# EAGLE design fix_it_in_sw (EAGLE 5.12)
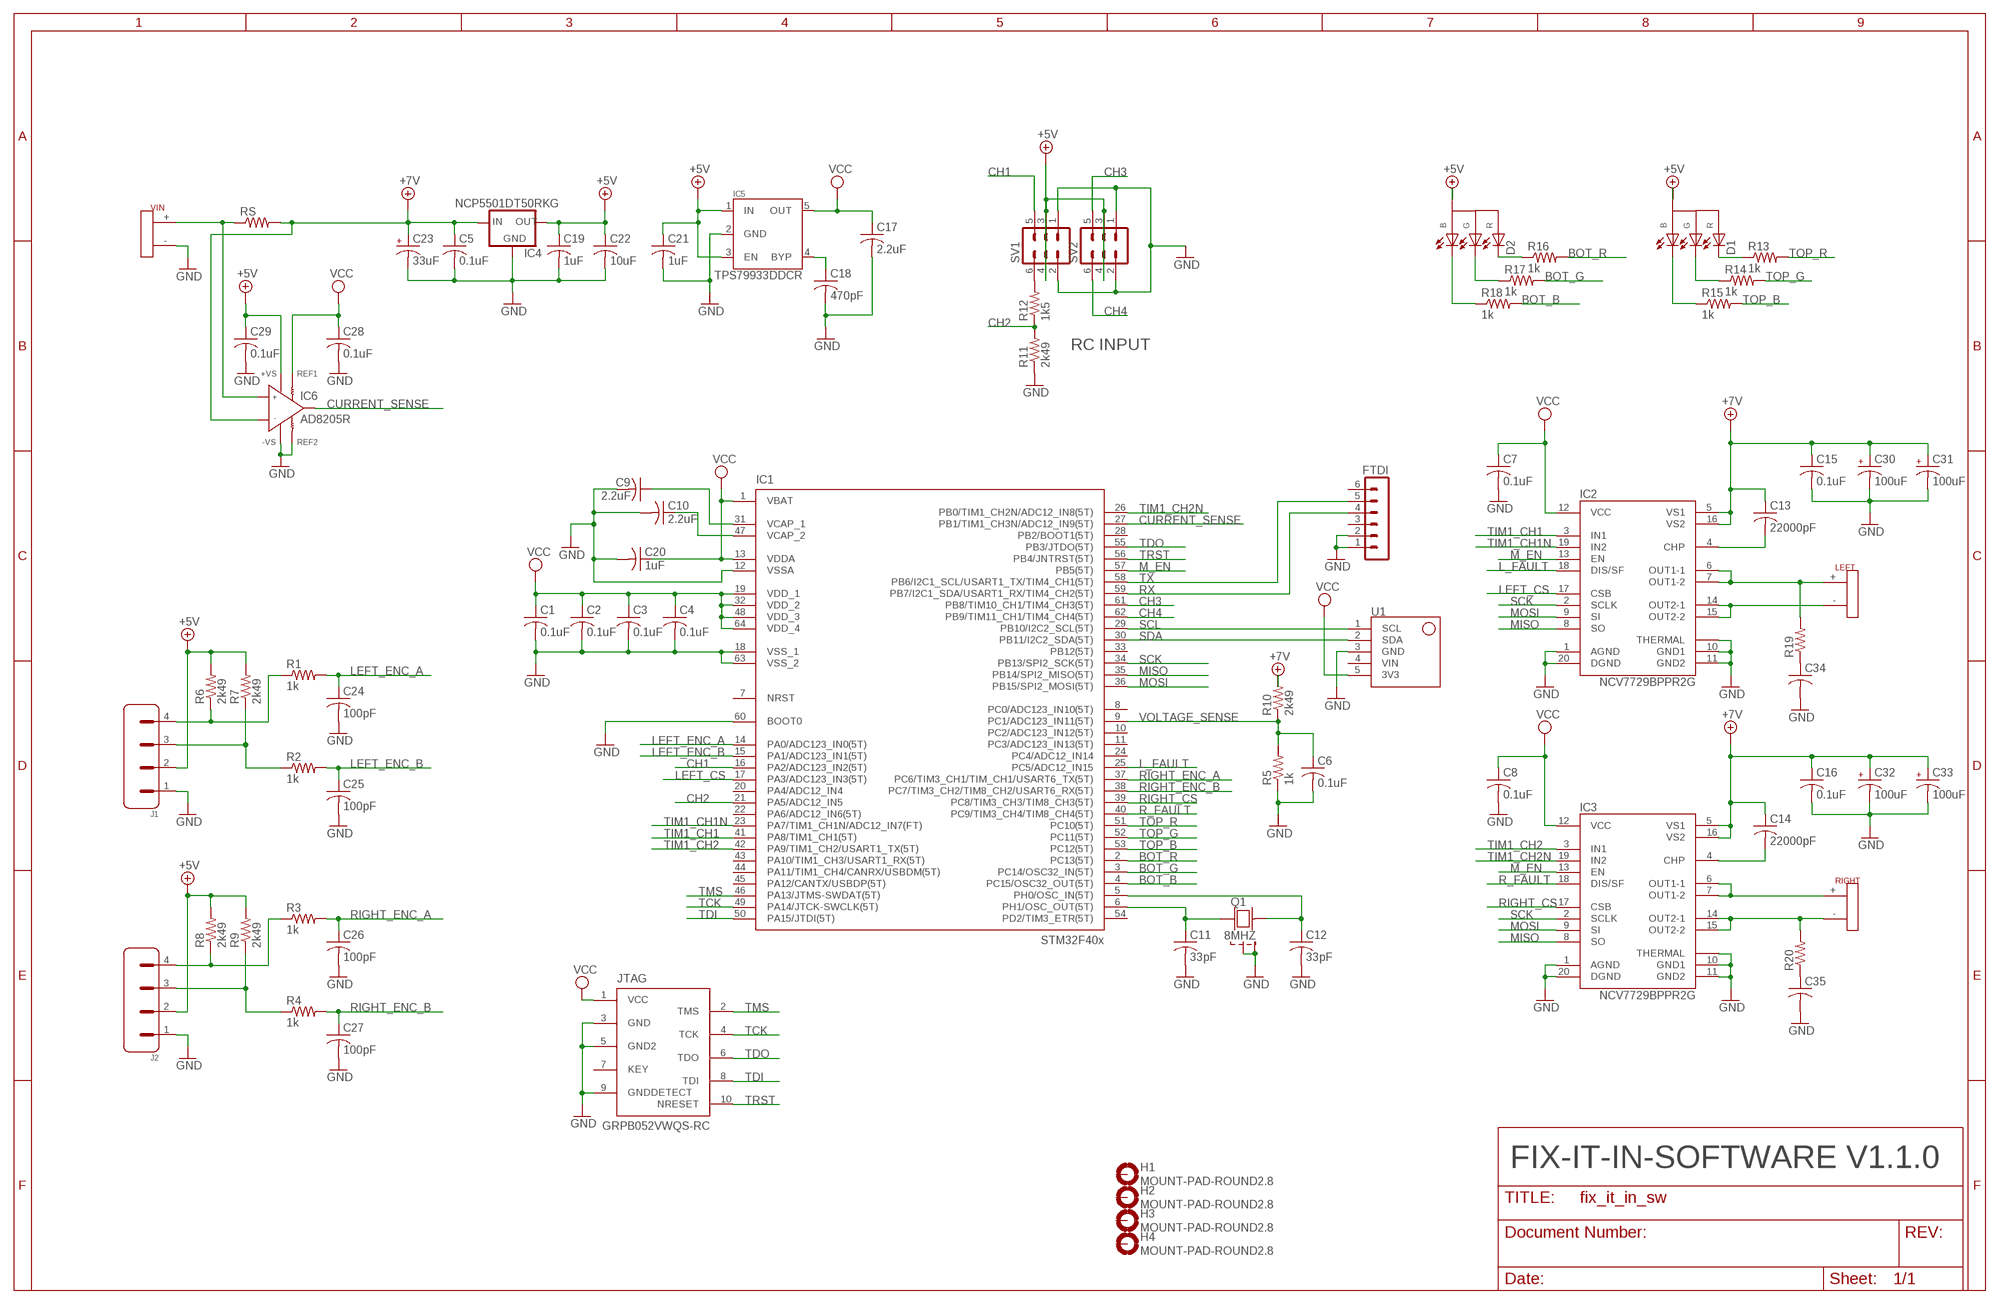
[diagram p0: schematic, sheet 1]

## Parts
C1  0.1uF  C1608X7R1H104K  [C0603]
C2  0.1uF  C1608X7R1H104K  [C0603]
C3  0.1uF  C1608X7R1H104K  [C0603]
C4  0.1uF  C1608X7R1H104K  [C0603]
C5  0.1uF  C1608X7R1H104K  [C0603]
C6  0.1uF  C1608X7R1H104K  [C0603]
C7  0.1uF  C1608X7R1H104K  [C0603]
C8  0.1uF  C1608X7R1H104K  [C0603]
C9  2.2uF  C1608X5R1C225K  [C0603]
C10  2.2uF  C1608X5R1C225K  [C0603]
C11  33pF  C-USC0402  [C0402]
C12  33pF  C-USC0402  [C0402]
C13  22000pF  C-USC0603  [C0603]
C14  22000pF  C-USC0603  [C0603]
C15  0.1uF  C1608X7R1H104K  [C0603]
C16  0.1uF  C1608X7R1H104K  [C0603]
C17  2.2uF  C1608X5R1C225K  [C0603]
C18  470pF  C-USC0603  [C0603]
C19  1uF  C-USC0603  [C0603]
C20  1uF  C-USC0603  [C0603]
C21  1uF  C-USC0603  [C0603]
C22  10uF  C-USC0603  [C0603]
C23  33uF  PCE3904CT-ND  [PANASONIC_C]
C24  100pF  C1608C0G1H101J  [C0603]
C25  100pF  C1608C0G1H101J  [C0603]
C26  100pF  C1608C0G1H101J  [C0603]
C27  100pF  C1608C0G1H101J  [C0603]
C28  0.1uF  C1608X7R1H104K  [C0603]
C29  0.1uF  C1608X7R1H104K  [C0603]
C30  100uF  RPS1C101MCN1GS  [PANASONIC_F]
C31  100uF  RPS1C101MCN1GS  [PANASONIC_F]
C32  100uF  RPS1C101MCN1GS  [PANASONIC_F]
C33  100uF  RPS1C101MCN1GS  [PANASONIC_F]
C34  C1608X7R1H104K  [C0603]
C35  C1608X7R1H104K  [C0603]
D1  CLV1A-FKB-CJ1M1F1BB7R4S3  [CREE-PLCC-4]
D2  CLV1A-FKB-CJ1M1F1BB7R4S3  [CREE-PLCC-4]
FTDI  MA06-1  [MA06-1]
H1  MOUNT-PAD-ROUND2.8  [2,8-PAD]
H2  MOUNT-PAD-ROUND2.8  [2,8-PAD]
H3  MOUNT-PAD-ROUND2.8  [2,8-PAD]
H4  MOUNT-PAD-ROUND2.8  [2,8-PAD]
IC1  STM32F405RG  [TQFP64]
IC2  NCV7729BPPR2G  [PSOP-20]
IC3  NCV7729BPPR2G  [PSOP-20]
IC4  NCP5501DT50RKG  [DPAK]
IC5  TPS79933DDCR  [SOT-23-5]
IC6  AD8205R  [SO8]
J1  502443-0470  [502443-0470]
J2  502443-0470  [502443-0470]
JTAG  GRPB052VWQS-RC  [DEBUG]
LEFT  POWER  [POWER]
Q1  8MHZ  ABM3B-8.000MHZ-B2-T  [4LCC]
R1  1k  R-US_R0603  [R0603]
R2  1k  R-US_R0603  [R0603]
R3  1k  R-US_R0603  [R0603]
R4  1k  R-US_R0603  [R0603]
R5  1k  R-US_R0603  [R0603]
R6  2k49  R-US_R0603  [R0603]
R7  2k49  R-US_R0603  [R0603]
R8  2k49  R-US_R0603  [R0603]
R9  2k49  R-US_R0603  [R0603]
R10  2k49  R-US_R0603  [R0603]
R11  2k49  R-US_R0603  [R0603]
R12  1k5  R-US_R0603  [R0603]
R13  1k  R-US_R0603  [R0603]
R14  1k  R-US_R0603  [R0603]
R15  1k  R-US_R0603  [R0603]
R16  1k  R-US_R0603  [R0603]
R17  1k  R-US_R0603  [R0603]
R18  1k  R-US_R0603  [R0603]
R19  R-US_R0603  [R0603]
R20  R-US_R0603  [R0603]
RIGHT  POWER  [POWER]
RS  R-US_R2512  [R2512]
SV1  MA03-2  [MA03-2]
SV2  MA03-2  [MA03-2]
U1  MINI9IMU  [MINI9IMU]
VIN  POWER  [POWER]

## Nets
+5V: C19.1 C21.1 C22.1 C29.1 D1.2 D2.2 IC4.3(OUT) IC5.1(IN) IC5.3(EN) IC6.6(+VS) J1.2 J2.2 R6.2 R7.2 R8.2 R9.2 SV1.3 SV1.4 SV2.3 SV2.4
+7V: C5.1 C13.1 C14.1 C15.1 C16.1 C23.+ C30.+ C31.+ C32.+ C33.+ IC2.5(VS1) IC2.16(VS2) IC3.5(VS1) IC3.16(VS2) IC4.1(IN) IC6.1(IN-) R10.2 RS.2
BOT_B: IC1.4(PC15/OSC32_OUT(5T)) R18.2
BOT_G: IC1.3(PC14/OSC32_IN(5T)) R17.2
BOT_R: IC1.2(PC13(5T)) R16.2
CH1: IC1.16(PA2/ADC123_IN2(5T)) SV1.5
CH2: IC1.21(PA5/ADC12_IN5) R11.2 R12.1
CH3: IC1.61(PB8/TIM10_CH1/TIM4_CH3(5T)) SV2.5
CH4: IC1.62(PB9/TIM11_CH1/TIM4_CH4(5T)) SV2.6
CURRENT_SENSE: IC1.27(PB1/TIM1_CH3N/ADC12_IN9(5T)) IC6.5(OUT)
GND: C1.2 C2.2 C3.2 C4.2 C5.2 C6.2 C7.2 C8.2 C9.2 C10.2 C11.2 C12.2 C15.2 C16.2 C17.2 C18.2 C19.2 C20.2 C21.2 C22.2 C23.- C24.2 C25.2 C26.2 C27.2 C28.2 C29.2 C30.- C31.- C32.- C33.- C34.2 C35.2 FTDI.1 FTDI.2 IC1.12(VSSA) IC1.18(VSS_1) IC1.60(BOOT0) IC1.63(VSS_2) IC2.1(AGND) IC2.10(GND1) IC2.11(GND2) IC2.20(DGND) IC2.THERMAL IC3.1(AGND) IC3.10(GND1) IC3.11(GND2) IC3.20(DGND) IC3.THERMAL IC4.4(GND) IC5.2(GND) IC6.2(-VS) IC6.3(REF2) J1.1 J2.1 JTAG.3(GND) JTAG.5(GND2) JTAG.9(GNDDETECT) Q1.2(G1) Q1.4(G2) R5.1 R11.1 SV1.1 SV1.2 SV2.1 SV2.2 U1.3(GND) VIN.-
L+: IC2.6(OUT1-1) IC2.7(OUT1-2) LEFT.+ R19.2
L-: IC2.14(OUT2-1) IC2.15(OUT2-2) LEFT.-
L_FAULT: IC1.25(PC5/ADC12_IN15) IC2.18(DIS/SF)
LEFT_CS: IC1.17(PA3/ADC123_IN3(5T)) IC2.17(CSB)
LEFT_ENC_A: C24.1 IC1.14(PA0/ADC123_IN0(5T)) R1.2
LEFT_ENC_B: C25.1 IC1.15(PA1/ADC123_IN1(5T)) R2.2
M_EN: IC1.57(PB5(5T)) IC2.13(EN) IC3.13(EN)
MISO: IC1.35(PB14/SPI2_MISO(5T)) IC2.8(SO) IC3.8(SO)
MOSI: IC1.36(PB15/SPI2_MOSI(5T)) IC2.9(SI) IC3.9(SI)
N$1: R12.2 SV1.6
N$2: C11.1 IC1.6(PH1/OSC_OUT(5T)) Q1.1
N$3: J1.4 R1.1 R6.1
N$4: C12.1 IC1.5(PH0/OSC_IN(5T)) Q1.3
N$5: J1.3 R2.1 R7.1
N$6: C9.1 IC1.31(VCAP_1)
N$7: C34.1 R19.1
N$8: C35.1 R20.1
N$11: C13.2 IC2.4(CHP)
N$13: J2.4 R3.1 R8.1
N$14: C10.1 IC1.47(VCAP_2)
N$15: C14.2 IC3.4(CHP)
N$16: C18.1 IC5.4(BYP)
N$17: D2.4 R18.1
N$18: J2.3 R4.1 R9.1
N$21: D2.3 R17.1
N$22: D2.1 R16.1
N$23: D1.1 R13.1
N$24: D1.3 R14.1
N$25: D1.4 R15.1
R+: IC3.6(OUT1-1) IC3.7(OUT1-2) RIGHT.+
R-: IC3.14(OUT2-1) IC3.15(OUT2-2) R20.2 RIGHT.-
R_FAULT: IC1.40(PC9/TIM3_CH4/TIM8_CH4(5T)) IC3.18(DIS/SF)
RIGHT_CS: IC1.39(PC8/TIM3_CH3/TIM8_CH3(5T)) IC3.17(CSB)
RIGHT_ENC_A: C26.1 IC1.37(PC6/TIM3_CH1/TIM_CH1/USART6_TX(5T)) R3.2
RIGHT_ENC_B: C27.1 IC1.38(PC7/TIM3_CH2/TIM8_CH2/USART6_RX(5T)) R4.2
RX: FTDI.4 IC1.59(PB7/I2C1_SDA/USART1_RX/TIM4_CH2(5T))
SCK: IC1.34(PB13/SPI2_SCK(5T)) IC2.2(SCLK) IC3.2(SCLK)
SCL: IC1.29(PB10/I2C2_SCL(5T)) U1.1(SCL)
SDA: IC1.30(PB11/I2C2_SDA(5T)) U1.2(SDA)
TCK: IC1.49(PA14/JTCK-SWCLK(5T)) JTAG.4(TCK)
TDI: IC1.50(PA15/JTDI(5T)) JTAG.8(TDI)
TDO: IC1.55(PB3/JTDO(5T)) JTAG.6(TDO)
TIM1_CH1: IC1.41(PA8/TIM1_CH1(5T)) IC2.3(IN1)
TIM1_CH1N: IC1.23(PA7/TIM1_CH1N/ADC12_IN7(FT)) IC2.19(IN2)
TIM1_CH2: IC1.42(PA9/TIM1_CH2/USART1_TX(5T)) IC3.3(IN1)
TIM1_CH2N: IC1.26(PB0/TIM1_CH2N/ADC12_IN8(5T)) IC3.19(IN2)
TMS: IC1.46(PA13/JTMS-SWDAT(5T)) JTAG.2(TMS)
TOP_B: IC1.53(PC12(5T)) R15.2
TOP_G: IC1.52(PC11(5T)) R14.2
TOP_R: IC1.51(PC10(5T)) R13.2
TRST: IC1.56(PB4/JNTRST(5T)) JTAG.10(NRESET)
TX: FTDI.5 IC1.58(PB6/I2C1_SCL/USART1_TX/TIM4_CH1(5T))
VCC: C1.1 C2.1 C3.1 C4.1 C7.1 C8.1 C17.1 C20.1 C28.1 IC1.1(VBAT) IC1.13(VDDA) IC1.19(VDD_1) IC1.32(VDD_2) IC1.48(VDD_3) IC1.64(VDD_4) IC2.12(VCC) IC3.12(VCC) IC5.5(OUT) IC6.7(REF1) JTAG.1(VCC) U1.5(3V3)
VIN: IC6.8(IN+) RS.1 VIN.+
VOLTAGE_SENSE: C6.1 IC1.9(PC1/ADC123_IN11(5T)) R5.2 R10.1
Unconnected: FTDI.3 FTDI.6 H1.B2,8(MOUNT) H2.B2,8(MOUNT) H3.B2,8(MOUNT) H4.B2,8(MOUNT) IC1.7(NRST) IC1.8(PC0/ADC123_IN10(5T)) IC1.10(PC2/ADC123_IN12(5T)) IC1.11(PC3/ADC123_IN13(5T)) IC1.20(PA4/ADC12_IN4) IC1.22(PA6/ADC12_IN6(5T)) IC1.24(PC4/ADC12_IN14) IC1.28(PB2/BOOT1(5T)) IC1.33(PB12(5T)) IC1.43(PA10/TIM1_CH3/USART1_RX(5T)) IC1.44(PA11/TIM1_CH4/CANRX/USBDM(5T)) IC1.45(PA12/CANTX/USBDP(5T)) IC1.54(PD2/TIM3_ETR(5T)) JTAG.7(KEY) U1.4(VIN)

## Notes on the sheet
- RC INPUT
- FIX-IT-IN-SOFTWARE V1.1.0

## Library data of the parts
C1-C8 C15 C16 C28 C29 = passive:C1608X7R1H104K: CAP CER 0.1UF 50V 10% X7R 0603
C9 C10 C17 = passive:C1608X5R1C225K: CAP CER 2.2UF 16V 10% X5R 0603
C11-C14 C18-C22 = rcl:C-US: CAPACITOR, American symbol
C23 = passive:PCE3904CT-ND: CAP ALUM 33uF 25V 5.00MM
C24-C27 = passive:C1608C0G1H101J: CAP CER 100PF 50V 5% NP0 0603
C30-C33 = passive:RPS1C101MCN1GS: CAP ALUM 100UF 16V 20% SMD Ripple Current: 3.2A ESR: 30mOhm Lifetime: 2000hrs @ 105C Size: 10mm x 10mm x 7.7mm
C34 C35 = passive:C1608X7R1H104K: CAP CER 0.1UF 50V 10% X7R 0603; VALUE: 0.1uF
D1 D2 = led:CLV1A-FKB-CJ1M1F1BB7R4S3: LED RED/GREEN/BLUE PLCC4 SMD reviewed: NO tested: NO
FTDI = con-lstb:MA06-1: PIN HEADER; OC_FARNELL: unknown; OC_NEWARK: unknown
H1-H4 = holes:MOUNT-PAD-ROUND: MOUNTING PAD, round
IC1 = stm32:STM32F405RG
IC2 IC3 = power:NCV7729BPPR2G: IC DRIVER DUAL H-BRIDGE 8A 20PSOP reviewed: NO tested: NO
IC4 = power:NCP5501DT50RKG: IC LDO REG 5V 500MA DPAK3 reviewed: NO tested: NO
IC5 = power:TPS79933DDCR: IC LDO REG 200MA 3.3V TSOT-23-5 reviewed: YES tested: YES
IC6 = robots:AD8205
J1 J2 = molex:502443-0470: Clik-Mate Vertical 4P 2.00mm reviewed: NO tested: NO
JTAG = stm32:GRPB052VWQS-RC: CONN HEADER 0.050" 10PS DL SMD AU reviewed: YES tested: YES
LEFT RIGHT VIN = robots:POWER
Q1 = stm32:ABM3B-8.000MHZ-B2-T: CRYSTAL, 8.000MHZ 18PF SMD reviewed: YES tested: YES
R1-R20 RS = rcl:R-US_: RESISTOR, American symbol
SV1 SV2 = con-lstb:MA03-2: PIN HEADER; OC_FARNELL: unknown; OC_NEWARK: unknown
U1 = robots:MINI9IMU

## Board
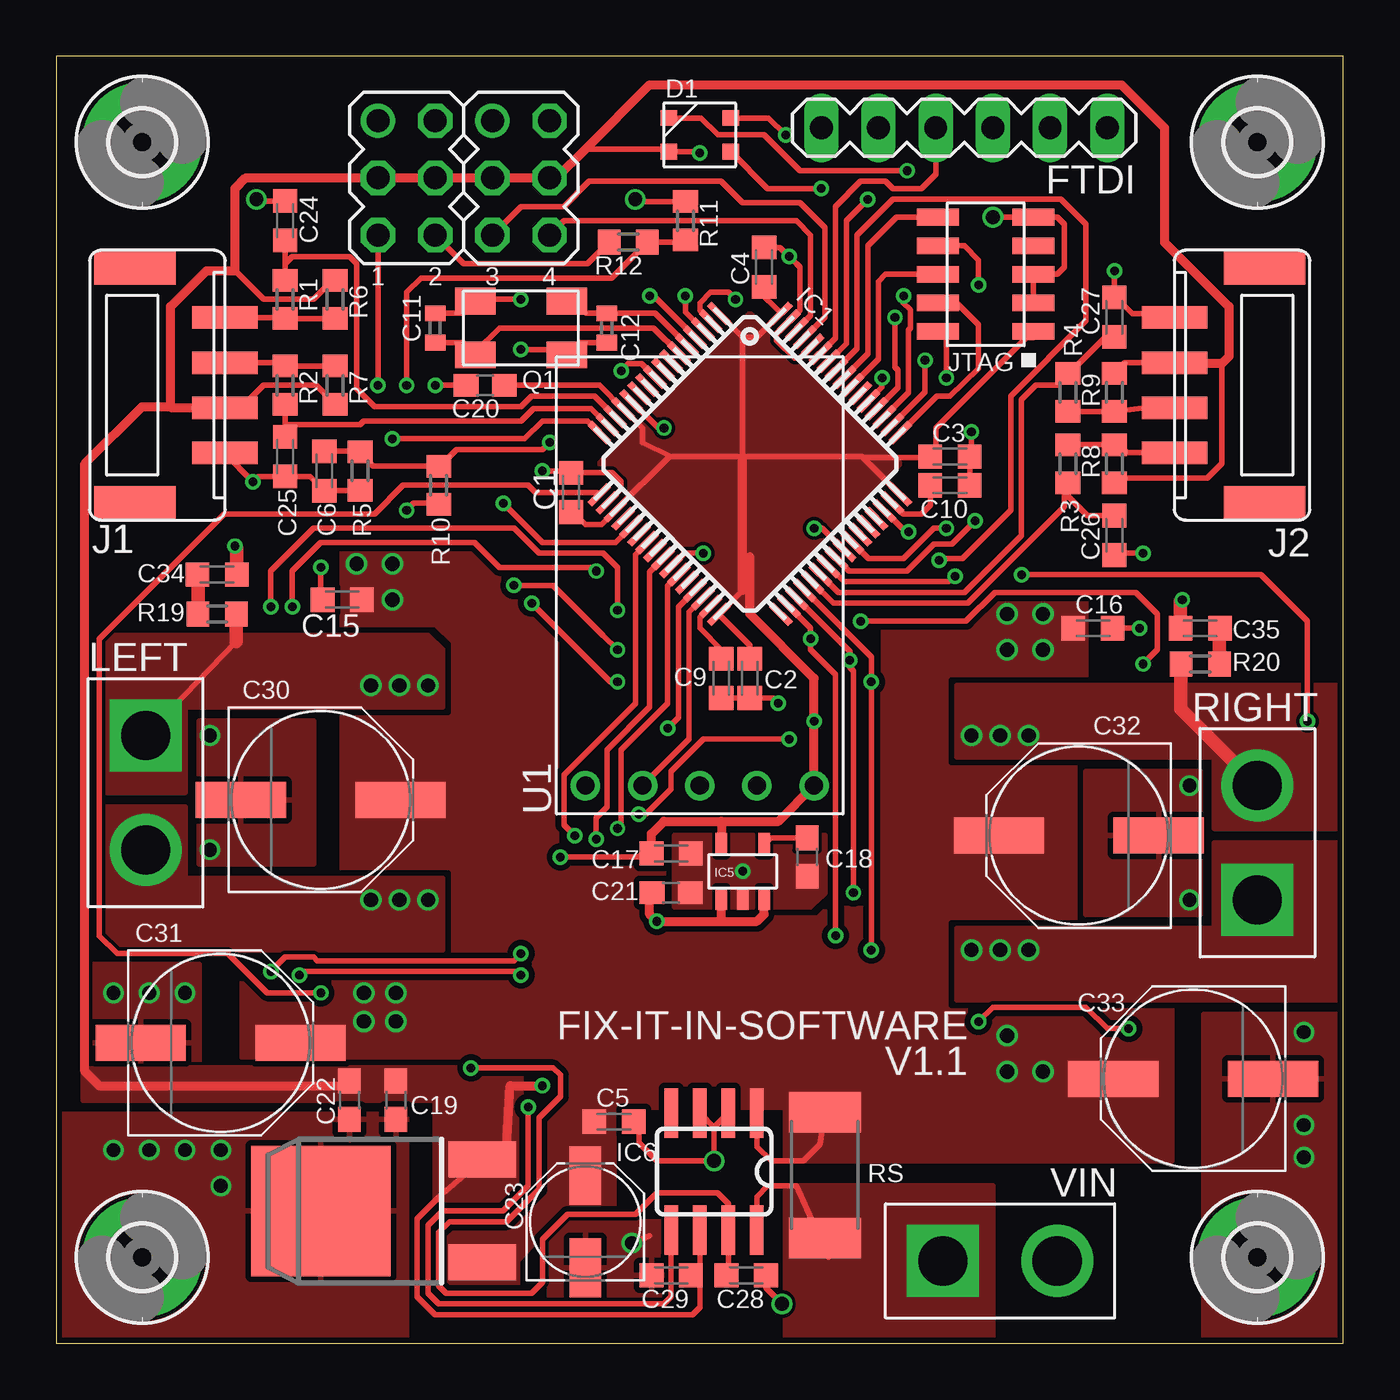
[diagram p1: board, top side]
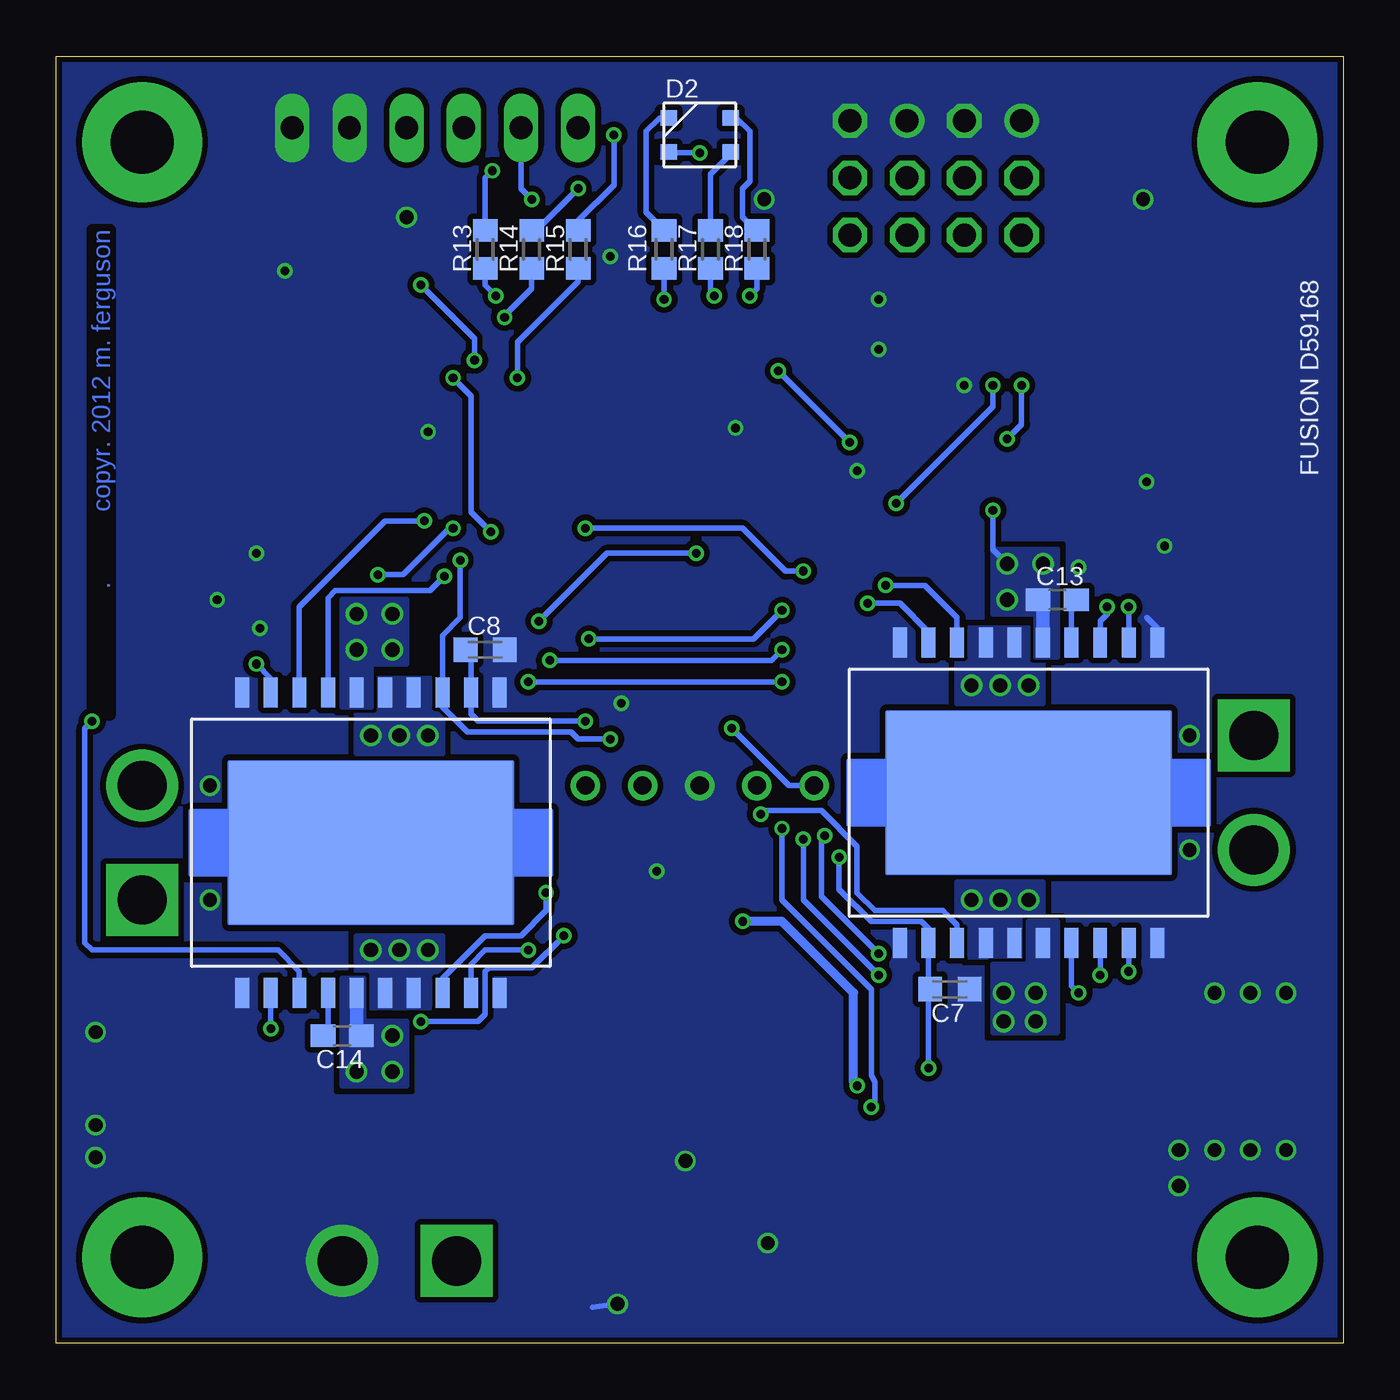
[diagram p2: board, bottom side, seen from below]

Size 57.15 x 57.15 mm. Coordinates in mm from the lower left corner, seen from the top.
Outline: 0,0 57.15,0 57.15,57.15 0,57.15 0,0
Copper layers (1*16): Top 0.035mm / dielectric 1.5mm / Bottom 0.035mm
Design rules "Fusion_eagle_rule_v1.1": minimum track width 6mil, minimum drill 12mil, track to track 6mil, track to pad 6mil, pad to pad 6mil, via to via 6mil, smd to smd 0mil, copper to edge 10mil, drill to drill 10mil, minimum pad ring 10mil, minimum via ring 6mil, stop-mask expansion 2mil, vias tented up to drill 100mil, thermal gap 10mil

### Footprints (pad centres in the part's own frame; a part is rotated, then mirrored left to right if it is on the bottom)
C0603 = smd 1.05 x 1.08: 1 -0.875,0; 2 0.875,0
C0402 = smd 0.7 x 0.9: 1 -0.65,0; 2 0.65,0
C0603' = smd 1.1 x 1: 1 -0.85,0; 2 0.85,0
PANASONIC_C = smd 2.6 x 1.4: + 2.05,0; - -2.05,0
PANASONIC_F = smd 4 x 1.6: + 3.55,0; - -3.55,0
CREE-PLCC-4 = smd 0.75 x 0.7: 1 -1.375,0.75; 2 -1.375,-0.75; 3 1.375,-0.75; 4 1.375,0.75
MA06-1 = drill 1.016 long: 1 -6.35,0; 2 -3.81,0; 3 -1.27,0; 4 1.27,0; 5 3.81,0; 6 6.35,0
2,8-PAD = drill 2.8 pad 5.334 round: B2,8 0,0
TQFP64 = smd 1.2 x 0.3: 1 -5.7,3.75; 2 -5.7,3.25; 3 -5.7,2.75; 4 -5.7,2.25; 5 -5.7,1.75; 6 -5.7,1.25; 7 -5.7,0.75; 8 -5.7,0.25; 9 -5.7,-0.25; 10 -5.7,-0.75; 11 -5.7,-1.25; 12 -5.7,-1.75; 13 -5.7,-2.25; 14 -5.7,-2.75; 15 -5.7,-3.25; 16 -5.7,-3.75; 33 5.7,-3.75; 34 5.7,-3.25; 35 5.7,-2.75; 36 5.7,-2.25; 37 5.7,-1.75; 38 5.7,-1.25; 39 5.7,-0.75; 40 5.7,-0.25; 41 5.7,0.25; 42 5.7,0.75; 43 5.7,1.25; 44 5.7,1.75; 45 5.7,2.25; 46 5.7,2.75; 47 5.7,3.25; 48 5.7,3.75 | smd 0.3 x 1.2: 17 -3.75,-5.7; 18 -3.25,-5.7; 19 -2.75,-5.7; 20 -2.25,-5.7; 21 -1.75,-5.7; 22 -1.25,-5.7; 23 -0.75,-5.7; 24 -0.25,-5.7; 25 0.25,-5.7; 26 0.75,-5.7; 27 1.25,-5.7; 28 1.75,-5.7; 29 2.25,-5.7; 30 2.75,-5.7; 31 3.25,-5.7; 32 3.75,-5.7; 49 3.75,5.7; 50 3.25,5.7; 51 2.75,5.7; 52 2.25,5.7; 53 1.75,5.7; 54 1.25,5.7; 55 0.75,5.7; 56 0.25,5.7; 57 -0.25,5.7; 58 -0.75,5.7; 59 -1.25,5.7; 60 -1.75,5.7; 61 -2.25,5.7; 62 -2.75,5.7; 63 -3.25,5.7; 64 -3.75,5.7
PSOP-20 = smd 1.33 x 0.62: 1 -6.665,5.715; 2 -6.665,4.445; 3 -6.665,3.175; 4 -6.665,1.905; 5 -6.665,0.635; 6 -6.665,-0.635; 7 -6.665,-1.905; 8 -6.665,-3.175; 9 -6.665,-4.445; 10 -6.665,-5.715; 11 6.665,-5.715; 12 6.665,-4.445; 13 6.665,-3.175; 14 6.665,-1.905; 15 6.665,-0.635; 16 6.665,0.635; 17 6.665,1.905; 18 6.665,3.175; 19 6.665,4.445; 20 6.665,5.715 | smd 7.2 x 12.6: THERMAL 0,0
DPAK = smd 3 x 1.6: 1 7.18,-2.29; 3 7.18,2.29 | smd 6.2 x 5.8: 4 0,0
SOT-23-5 = smd 0.508 x 1.016: 1 -0.95,-1.2; 2 0,-1.2; 3 0.95,-1.2; 4 0.95,1.2; 5 -0.95,1.2
SO8 = smd 0.6 x 2.2: 1 -1.905,-2.6; 2 -0.635,-2.6; 3 0.635,-2.6; 4 1.905,-2.6; 5 1.905,2.6; 6 0.635,2.6; 7 -0.635,2.6; 8 -1.905,2.6
502443-0470 = smd 1 x 2.9: 1 3,4; 2 1,4; 3 -1,4; 4 -3,4 | smd 1.45 x 3.6: P$5 -5.2,0; P$6 5.2,0
DEBUG = smd 1.854 x 0.737: 1 -2.121,2.54; 2 2.121,2.54; 3 -2.121,1.27; 4 2.121,1.27; 5 -2.121,0; 6 2.121,0; 7 -2.121,-1.27; 8 2.121,-1.27; 9 -2.121,-2.54; 10 2.121,-2.54
POWER = drill 2.184 square: + 0,0 | drill 2.184 round: - 5.08,0
4LCC = smd 1.803 x 1.194: 1 -2.032,-1.194; 2 2.032,-1.194; 3 2.032,1.194; 4 -2.032,1.194
R0603 = smd 1 x 1.1: 1 -0.85,0; 2 0.85,0
R2512 = smd 1.8 x 3.2: 1 -2.8,0; 2 2.8,0
MA03-2 = drill 1.016 round: 1 -2.54,-1.27 | drill 1.016 octagon: 2 -2.54,1.27; 3 0,-1.27; 4 0,1.27; 5 2.54,-1.27; 6 2.54,1.27
MINI9IMU = drill 0.8 round: 1 0,5.08; 2 0,2.54; 3 0,0; 4 0,-2.54; 5 0,-5.08

### Placement (x,y rotation side)
C1  22.86,37.78 90 top
C2  30.8,29.53 270 top
C3  39.69,39.37 0 top
C4  31.43,47.78 90 top
C5  24.77,9.84 0 top
C6  11.91,38.73 270 top
C7  17.46,15.72 0 bottom
C8  38.1,30.8 0 bottom
C9  29.53,29.53 270 top
C10  39.69,38.1 0 top
C11  16.83,45.09 90 top
C12  24.45,45.09 270 top
C13  22000pF  [C0603']  12.7,33.02 0 bottom
C14  22000pF  [C0603']  44.45,13.65 180 bottom
C15  12.7,33.02 180 top
C16  46.04,31.75 0 top
C17  27.3,21.75 0 top
C18  470pF  [C0603']  33.34,21.59 270 top
C19  1uF  [C0603']  15.08,10.79 270 top
C20  1uF  [C0603']  19.05,42.55 180 top
C21  1uF  [C0603']  27.3,20 0 top
C22  10uF  [C0603']  13.02,10.79 270 top
C23  23.5,5.4 90 top
C24  10.16,49.85 90 top
C25  10.16,39.37 270 top
C26  46.99,35.88 270 top
C27  46.99,45.56 90 top
C28  30.64,3.02 0 top
C29  27.3,3.02 180 top
C30  11.75,24.13 0 top
C31  7.3,13.34 0 top
C32  45.4,22.54 180 top
C33  50.48,11.75 180 top
C34  7.14,34.13 0 top
C35  50.8,31.75 180 top
D1  28.57,53.66 0 top
D2  28.57,53.66 0 bottom
FTDI  40.32,53.98 180 top
H1  53.34,53.34 0 top
H2  3.81,53.34 0 top
H3  53.34,3.81 0 top
H4  3.81,3.81 0 top
IC1  30.8,39.05 315 top
IC2  13.97,24.45 270 bottom
IC3  43.18,22.23 90 bottom
IC4  11.75,5.87 0 top
IC5  30.48,20.95 0 top
IC6  29.21,7.62 180 top
J1  3.49,42.55 270 top
J2  53.66,42.55 90 top
JTAG  41.27,47.47 180 top
LEFT  3.97,26.99 270 top
Q1  20.64,45.09 0 top
R1  10.16,46.35 90 top
R2  10.16,42.55 270 top
R3  44.93,39.05 270 top
R4  44.93,42.23 90 top
R5  13.49,38.73 90 top
R6  12.38,46.35 90 top
R7  12.38,42.55 270 top
R8  46.99,39.05 270 top
R9  46.99,42.23 90 top
R10  16.99,38.1 270 top
R11  27.94,49.85 270 top
R12  25.4,48.9 180 top
R13  38.1,48.58 270 bottom
R14  36.04,48.58 270 bottom
R15  33.97,48.58 270 bottom
R16  30.16,48.58 270 bottom
R17  28.1,48.58 270 bottom
R18  26.04,48.58 270 bottom
R19  7.14,32.38 0 top
R20  50.8,30.16 180 top
RIGHT  53.34,19.68 90 top
RS  34.13,7.46 90 top
SV1  15.56,51.75 270 top
SV2  20.64,51.75 270 top
U1  28.57,24.77 90 top
VIN  39.37,3.65 0 top

### Tracks (layer width: path | path; a pad name or v marks a point on that pad's centre or on a via)
+5V  (via drill 0.38)
  Top 0.254: 28.57,3.09 C29.1 | J1.2 8.21,41.55 9.21,42.55 11.53,42.55 R7.2 | R6.2 12.28,47.2 11.43,46.35 9.21,46.35 7.94,47.62 | R8.2 47.09,38.42 51.12,38.42 51.75,39.05 51.75,43.5 | R9.2 47.46,43.55 J2.2 | 28.57,3.09 28.57,1.59 28.26,1.27 16.83,1.27 16.03,2.06 16.03,5.53 17,6.5 | 28.57,3.09 IC6.6 | 17,6.5 16.83,6.35 | 17,6.5 IC4.3 | 23.5,53.02 27.09,53.02 D1.2 28.3,52.91 v28.57,52.86
  Top 0.406: 31.43,19.37 IC5.3 31.43,19.05 31.11,18.73 29.53,18.73 | IC4.3 20,8.76 20.16,11.43 v21.59,11.43 | 29.53,18.73 v26.67,18.73 26.35,19.05 26.35,19.9 | 26.35,19.9 C21.1 | IC5.1 29.53,18.73 | 26.35,19.9 26.35,20 | C22.1 12.6,11.43 1.91,11.43 1.27,12.06 1.27,39.05 3.81,41.59 5.08,41.59 | 5.08,41.59 5.08,46.04 6.67,47.62 7.94,47.62 7.94,51.28 8.41,51.75 SV1.3 SV1.4 SV2.3 SV2.4 22.23,51.75 23.5,53.02 26.35,55.88 47.31,55.88 49.21,53.98 49.21,48.9 52.07,46.04 52.07,43.81 51.75,43.5 49.7,43.5 J2.2 | J1.2 5.13,41.55 5.08,41.59
  Bottom 0.254: D2.2 29.91,52.86 v28.57,52.86
  Bottom 0.406: v26.67,18.73 24.92,18.73 21.75,15.56 21.75,11.59 v21.59,11.43
  pour Top (isolate 0.254, no thermals): 16.83,6.35 17.46,6.35 19.68,6.35 20.64,7.3 20.64,12.22 1.59,12.22 1.27,12.06 1.19,12.06 1.19,10.79 16.83,10.79
+7V  (via drill 0.38, 0.64)
  Top 0.254: RS.2 33.91,8.83 33.18,8.1 31.75,8.1 31.11,8.73 IC6.1 | 16.73,37.31 R10.2 | v15.56,36.99 15.88,37.31 16.73,37.31 | 16.73,37.31 17.14,37.31
  Bottom 0.254: 13.34,33.12 C13.1 | C14.1 43.81,13.87 | v15.56,36.99 15.56,35.88 15.56,35.24 v14.92,34.61
  Bottom 0.61: IC2.5 13.34,33.12 | 43.81,13.87 IC3.5
  other vias: 42.23,13.65 42.23,12.06 43.81,12.06 42.23,30.8 14.92,33.02 15.08,15.56 13.65,15.56 13.65,14.29 15.08,14.29 13.34,34.61 43.81,30.8 43.81,32.38 42.23,32.38
  pour Top (isolate 0.254, rank 3, no thermals): 16.83,0.16 20.48,0.16 20.48,3.65 22.7,6.03 24.77,6.03 24.77,10.48 32.38,10.48 32.38,8.1 49.53,8.1 49.53,14.92 45.72,14.92 45.72,33.34 36.75,33.34 36.67,21.75 22.23,21.59 22.23,35.56 12.7,35.56 12.7,17.14 8.26,17.14 8.26,12.7 21.59,12.7 21.59,7.62 19.53,5.56 16.83,5.56
  pour Bottom (no thermals): 43.5,16.19 44.45,16.19 44.45,11.43 41.59,11.43 41.59,14.29 43.5,14.29
  pour Bottom (no thermals): 43.18,28.26 44.45,28.26 44.45,33.02 41.59,33.02 41.59,30.16 43.18,30.16
  pour Bottom (no thermals): 13.97,18.73 12.7,18.73 12.7,13.81 15.56,13.81 15.56,16.83 13.97,16.83
  pour Bottom (no thermals): 13.65,30.48 12.7,30.48 12.7,35.24 15.56,35.24 15.56,32.38 13.65,32.38
BOT_B  (via drill 0.38)
  Top 0.254: IC1.4 26.52,46.51 v26.35,46.51
  Bottom 0.254: v26.35,46.51 26.04,46.83 R18.2
BOT_G  (via drill 0.38)
  Top 0.254: IC1.3 27.94,45.8 v27.94,46.51
  Bottom 0.254: v27.94,46.51 28.1,46.67 R17.2
BOT_R  (via drill 0.38)
  Top 0.254: IC1.2 28.57,45.87 28.57,46.2 29.05,46.67 29.84,46.67 v30.16,46.35
  Bottom 0.254: v30.16,46.35 R16.2
CH1  (via drill 0.38)
  Top 0.254: IC1.16 23.59,40.96 21.59,40.96 20.8,40.16 v14.92,40.16 | v14.29,42.55 SV1.5
  Bottom 0.254: v14.92,40.16 14.29,40.8 v14.29,42.55
CH2  (via drill 0.38)
  Top 0.254: R11.2 27.84,48.9 R12.1 24.66,47.31 16.19,47.31 15.56,46.67 v15.56,42.55 | IC1.21 24.83,35.56 21.59,35.56 20.8,36.35 v19.84,37.31
  Bottom 0.254: v19.84,37.31 15.56,41.59 v15.56,42.55
CH3
  Top 0.254: IC1.61 34.13,45.57 34.13,49.53 33.02,50.64 30.48,50.64 29.53,51.59 23.65,51.59 22.54,50.48 20.64,50.48 SV2.5
CH4
  Top 0.254: IC1.62 33.5,45.64 33.5,49.21 32.86,49.85 22.54,49.85 SV2.6
CURRENT_SENSE  (via drill 0.38)
  Top 0.254: IC1.27 27.15,33.63 27.15,28.42 25.08,26.35 25.08,23.02 v24.92,22.86 | v20.95,10.48 20.95,10.16 20.95,6.99 19.84,5.87 17.14,5.87 16.51,5.24 16.51,2.22 16.99,1.75 26.99,1.75 27.3,2.06 IC6.5
  Bottom 0.254: v20.95,10.48 20.8,10.64 20.8,11.59 20.95,11.91 20.95,15.72 24.77,19.53 24.92,19.68 v24.92,22.86
GND  (via drill 0.38, 0.61)
  Top 0.254: 46.91,46.59 47.78,45.72 49.48,45.72 | 23.67,2.22 C23.- | R11.1 25.82,50.7 v25.72,50.8 | C24.2 8.89,50.72 v8.89,50.8 | v16.83,42.55 C20.2 | C10.2 C3.2 40.48,39.37 40.64,39.53 v40.64,40.48 | C26.2 47.07,35.08 v48.26,35.08 | C27.2 v46.99,47.62 | v41.59,50.01 JTAG.9 44.45,50.01 44.77,49.69 44.77,47.78 44.45,47.47 JTAG.5 JTAG.3 | C11.2 18.06,45.73 Q1.4 18.68,46.35 v20.64,46.35 | C5.2 25.88,9.45 25.88,8.89 26.67,8.1 v29.21,8.1 29.21,9.59 | v25.56,4.45 26.35,4.76 | 29.21,9.59 IC6.2 | 29.21,9.59 IC6.3 | 30.48,28.57 31.04,28.65 C2.2 | IC1.12 26.73,40.64 v26.99,40.64 | v20.64,44.13 22.43,44.13 Q1.2 23.21,44.44 C12.2 | R5.1 13.47,37.86 C6.2 11.27,38.49 C25.2 8.97,38.49 v8.73,38.26 7.49,39.5 J1.1 | C16.2 v48.1,31.75 | C9.2 C2.2 | v32.07,28.42 31.83,28.65 C2.2 | C15.2 11.75,33.02 v11.75,34.45 | v21.59,38.73 22.78,38.73 C1.2 24.68,38.66 25.08,38.26 25.08,37.93 IC1.18 | C4.2 32.15,48.66 v32.54,48.26 32.86,47.94 33.02,47.78 33.02,45.87 IC1.63 31.99,44.84 31.99,44.53 32.78,43.74 33.02,43.74 33.59,44.31 IC1.60 | C28.2 31.51,2.46 v32.23,1.75
  Top 0.305: C27.2 46.91,46.59 | 49.48,45.72 J2.1
  Top 0.61: C34.2 8.02,35.32 v7.94,35.4 | C35.2 49.92,32.94 v50.01,33.02
  Bottom 0.254: v32.23,1.75 33.34,1.59 | IC2.1 8.26,31.75 8.73,32.23
  other vias: 7.3,8.57 5.71,8.57 4.13,8.57 2.54,8.57 7.3,6.99 50.32,19.68 50.32,24.77 6.83,26.99 6.83,21.91 2.54,15.56 4.13,15.56 5.71,15.56 55.4,13.81 55.4,9.68 55.4,8.25 30.48,20.95
  pour Bottom (isolate 0.254, rank 3, no thermals): 0,57.15 57.15,57.15 57.15,0 0,0
  pour Top: 21.91,0 21.91,4.76 22.54,5.4 27.3,5.4 27.3,0
  pour Top: 15.56,10.16 15.56,0 0,0 0,10.16
  pour Top: 45.72,25.4 50.8,25.4 50.8,19.05 45.72,19.05
  pour Top: 6.35,27.62 11.43,27.62 11.43,21.27 6.35,21.27
  pour Top (rank 2): 0,16.83 6.35,16.83 6.35,12.38 0,12.38
  pour Top: 50.96,14.61 56.99,14.61 56.83,0.32 50.96,0.32
  pour Top (no thermals): 27.46,22.54 34.13,22.54 34.13,21.91 34.13,21.91 34.13,21.75 34.13,20 33.97,19.84 33.97,19.84 33.5,19.37 27.46,19.37
L+  (via drill 0.64)
  Top 0.254: LEFT.+ 7.99,31.17
  Top 0.61: 7.99,31.17 R19.2
  other vias: 13.97,29.21 15.24,29.21 16.51,29.21
  pour Top (no thermals): 0,24.45 5.71,24.45 5.71,28.26 17.14,28.26 17.14,30.8 16.51,31.43 0,31.43
  pour Bottom (rank 2, no thermals): 13.34,28.42 13.34,31.75 17.14,31.75 17.14,28.42
L-  (via drill 0.64)
  other vias: 13.97,19.68 15.24,19.68 16.51,19.68
  pour Bottom (rank 2, no thermals): 17.14,20.48 17.14,17.14 13.34,17.14 13.34,20.48
  pour Top (rank 2, no thermals): 5.71,23.81 0,23.81 0,17.46 17.14,17.46 17.14,20.64 5.71,20.64
L_FAULT  (via drill 0.38)
  Top 0.254: IC1.25 26.35,34.25 26.35,28.26 24.45,26.35 24.45,23.81 23.97,23.34 v23.97,22.38 | v10.79,16.35 | v10.79,16.35 | v10.79,16.35 10.95,16.51 20.48,16.51 v20.64,16.35
  Bottom 0.254: v10.79,16.35 IC2.18 | v23.97,22.38 23.97,19.68 v20.64,16.35
LEFT_CS  (via drill 0.38)
  Top 0.254: IC1.17 24.01,37.78 21.27,37.78 20.95,38.1 15.4,38.1 14.13,36.83 7.46,36.83 1.91,31.27 1.91,18.1 2.7,17.3 7.62,17.3 9.37,15.56 v11.75,15.56
  Bottom 0.254: IC2.17 12.06,15.88 v11.75,15.56
LEFT_ENC_A
  Top 0.254: 10.16,47.94 R1.2 | 10.16,47.94 C24.1 | IC1.14 23.89,42.07 21.11,42.07 20.64,41.59 14.13,41.59 13.34,42.39 13.34,47.94 13.02,48.26 10.48,48.26 10.16,47.94
LEFT_ENC_B
  Top 0.254: C25.1 R2.2 | IC1.15 23.74,41.52 21.2,41.52 20.64,40.96 13.65,40.96 13.49,40.8 10.16,40.8 C25.1 | C25.1 10.16,40.01
M_EN  (via drill 0.38)
  Top 0.254: IC1.57 35.56,44.17 35.56,49.21 37.15,50.8 44.61,50.8 45.72,49.69 45.72,45.4 42.39,42.07 42.39,36.99 41.91,36.51 40.24,34.85 39.29,34.85 v39.21,34.77 | v39.21,34.77 | v32.54,26.83 28.73,26.83 27.3,25.4 27.3,24.61 26.19,23.5 v25.88,23.5
  Bottom 0.254: v39.21,34.77 39.21,32.23 40.01,31.43 IC3.13 40.01,28.26 38.89,27.15 34.29,27.15 33.97,26.83 v32.54,26.83 | IC2.13 17.14,18.57 17.62,19.05 | 17.62,19.05 | 17.62,19.05 17.78,19.21 20.8,19.21 21.59,20 21.59,22.07 23.18,23.65 25.72,23.65 v25.88,23.5
MISO  (via drill 0.38)
  Top 0.254: v35.4,20 35.4,29.84 35.24,30 v35.24,30.32 35.24,30.72 IC1.35 | v20.32,33.66 22.07,33.66 24.29,31.43 v24.92,30.8
  Bottom 0.254: IC3.8 40.01,16.19 38.1,18.1 36.51,18.1 35.4,19.21 v35.4,20 | IC2.8 17.14,32.23 18.57,33.66 v20.32,33.66 | v24.92,30.8 25.4,30.32 26.67,30.32 v35.24,30.32
MOSI  (via drill 0.38)
  Top 0.254: IC1.36 36.2,30.47 v36.2,29.37 v36.2,17.46 | v21.11,32.86 | v21.11,32.86 21.91,32.07 24.61,29.37 v24.92,29.37
  Bottom 0.254: IC3.9 38.73,16.83 38.1,17.46 v36.2,17.46 | IC2.9 18.41,31.59 19.69,32.86 v21.11,32.86 | v24.92,29.37 v36.2,29.37
N$1
  Top 0.254: SV1.6 18.1,47.94 23.6,47.94 R12.2
N$2
  Top 0.254: C11.1 18.06,44.44 Q1.1 18.61,44.01 19.68,45.09 26.53,45.09 IC1.6
N$3
  Top 0.254: J1.4 10.12,45.55 R1.1 R6.1
N$4
  Top 0.254: Q1.3 23.53,45.73 C12.1 26.59,45.73 IC1.5
N$5
  Top 0.254: J1.3 10.01,43.55 R2.1 R7.1
N$6
  Top 0.254: IC1.31 28.57,32.23 28.57,31.75 29.53,30.8 C9.1
N$7
  Top 0.61: R19.1 6.29,34.11 C34.1
N$8
  Top 0.61: R20.1 51.65,31.73 C35.1
N$11
  Bottom 0.254: IC2.4 12.06,33.12 C13.2
N$13
  Top 0.254: J2.4 47.62,39.55 R8.1 R3.1
N$14
  Top 0.254: IC1.47 37.62,36.83 38.42,36.83 38.81,37.23 C10.1
N$15
  Bottom 0.254: IC3.4 45.09,13.87 C14.2
N$16
  Top 0.254: C18.1 31.71,22.44 IC5.4
N$17
  Bottom 0.254: R18.1 26.04,49.37 26.67,50.01 26.67,51.28 26.35,51.59 26.35,53.82 26.94,54.41 D2.4
N$18
  Top 0.254: R4.1 R9.1 49.66,41.7
  Top 0.305: 49.66,41.7 J2.3
N$21
  Bottom 0.254: R17.1 | R17.1 28.1,51.91 27.2,52.81 D2.3
N$22
  Bottom 0.254: R16.1 30.96,50.22 30.96,53.82 30.36,54.41 D2.1
N$23  (via drill 0.38)
  Top 0.254: v37.78,52.07 33.02,52.07 31.43,53.66 29.38,53.66 28.63,54.41 D1.1
  Bottom 0.254: R13.1 38.1,51.75 v37.78,52.07 | v37.78,52.07
N$24  (via drill 0.38)
  Top 0.254: v33.97,51.28 31.59,51.28 D1.3
  Bottom 0.254: R14.1 35.72,49.53 v33.97,51.28
N$25  (via drill 0.38)
  Top 0.254: v32.38,53.66 31.64,54.41 D1.4
  Bottom 0.254: R15.1 33.97,49.85 32.38,51.44 v32.38,53.66
R+  (via drill 0.64)
  other vias: 40.64,17.46 41.91,17.46 43.18,17.46
  pour Bottom (rank 2, no thermals): 43.81,18.1 43.81,14.92 40.01,14.92 40.01,18.1
  pour Top (no thermals): 57.15,22.23 51.44,22.23 51.44,18.41 40.01,18.41 40.01,15.24 57.15,15.24
R-  (via drill 0.64)
  Top 0.61: R20.2 49.95,28.16 RIGHT.-
  other vias: 40.64,26.99 41.91,26.99 43.18,26.99
  pour Bottom (rank 2, no thermals): 40.01,26.19 40.01,29.53 43.81,29.53 43.81,26.19
  pour Top (no thermals): 51.44,22.86 57.15,22.86 57.15,29.21 40.01,29.21 40.01,26.04 51.44,26.04
R_FAULT  (via drill 0.38)
  Top 0.254: IC1.40 35.21,34.29 37.78,34.29 38.97,35.48 39.53,35.48 | 39.53,35.48 | 39.53,35.48 39.77,35.48 | 39.77,35.48 39.85,35.56 | 39.77,35.48 v40.8,36.51
  Bottom 0.254: IC3.18 46.35,32.7 42.55,36.51 v40.8,36.51
RIGHT_CS  (via drill 0.38)
  Top 0.254: IC1.39 34.98,33.81 39.61,33.81 v39.93,34.05
  Bottom 0.254: v39.93,34.05 40.56,33.42 44.77,33.42 45.09,33.1 IC3.17
RIGHT_ENC_A
  Top 0.254: IC1.37 34.51,32.86 40.48,32.86 44.77,37.15 44.77,37.78 | 44.77,37.78 R3.2 | 44.77,37.78 45.8,36.75 C26.1
RIGHT_ENC_B
  Top 0.254: 44.77,42.86 44.45,42.55 43.5,42.55 42.86,41.91 42.86,35.88 40.32,33.34 34.74,33.34 IC1.38 | R4.2 45.3,43.4 46.67,44.77
  Top 0.305: 44.77,42.86 R4.2 | 46.67,44.77 C27.1
RX
  Top 0.254: IC1.59 34.61,44.63 34.61,50.48 35.72,51.59 36.83,51.59 37.15,51.28 38.42,51.28 39.05,51.91 FTDI.4
SCK  (via drill 0.38)
  Top 0.254: v34.61,18.1 34.61,29.69 33.5,30.8 v33.5,31.27 33.5,31.75 IC1.34 | v40.96,14.29 41.59,14.92 45.72,14.92 46.67,13.97 v47.62,13.97 | v9.53,32.7 9.53,34.29 11.43,36.2 20.32,36.2 21.43,35.08 23.81,35.08 24.29,35.08 24.92,34.45 v24.92,32.54
  Bottom 0.254: v34.61,18.1 36.04,16.67 37.94,16.67 38.1,16.51 38.1,14.61 38.42,14.29 v40.96,14.29 | v47.62,13.97 IC3.2 | IC2.2 v9.53,32.7 | v24.92,32.54 26.2,31.28 v33.49,31.28 v33.5,31.27
SCL  (via drill 0.38)
  Top 0.254: IC1.29 27.62,32.7 27.62,27.78 v27.15,27.3
  Bottom 0.254: U1.1 24.61,24.77 v27.15,27.3
SDA
  Top 0.254: IC1.30 28.1,32.47 28.1,26.83 26.35,25.08 U1.2
TCK
  Top 0.254: IC1.49 39.12,42.07 39.69,42.07 40.96,43.27 40.96,45.24 40.01,46.2 JTAG.4
TDI  (via drill 0.38)
  Top 0.254: IC1.50 38.58,42.23 v38.58,43.66 | v40.96,46.99 40.96,48.1 40.32,48.74 JTAG.8
  Bottom 0.254: v38.58,43.66 38.58,44.61 v40.96,46.99
TDO
  Top 0.254: IC1.55 36.51,43.71 36.51,47.15 36.83,47.47 JTAG.6
TIM1_CH1  (via drill 0.38)
  Top 0.254: IC1.41 34.01,36.2 v33.66,36.2 | v10.48,32.7 10.48,34.29 11.75,35.56 18.57,35.56 19.68,34.45 23.65,34.45 23.81,34.45 v23.97,34.29
  Bottom 0.254: v33.66,36.2 26.67,36.2 24.77,34.29 v23.97,34.29 | IC2.3 10.79,32.07 10.48,32.38 v10.48,32.7
TIM1_CH1N  (via drill 0.38)
  Top 0.254: IC1.23 25.72,35.03 25.72,28.42 22.54,25.24 22.54,23.02 v23.02,22.54 | v9.53,16.51 10.16,17.14 11.43,17.14 11.59,16.99 20.32,16.99 v20.64,17.3 | v23.02,22.54
  Bottom 0.254: v9.53,16.51 IC2.19 | v20.64,17.3 23.18,19.84 23.18,22.38 v23.02,22.54
TIM1_CH2  (via drill 0.38)
  Top 0.254: v55.56,27.62 55.56,32.07 53.5,34.13 v42.86,34.13 | v39.53,36.2 38.97,36.2 37.62,34.85 36.06,34.85 IC1.42
  Bottom 0.254: IC3.3 46.35,16.51 47.31,17.46 55.56,17.46 55.88,17.78 55.88,27.3 v55.56,27.62 | v42.86,34.13 41.75,34.13 39.69,36.2 v39.53,36.2
TIM1_CH2N  (via drill 0.38)
  Top 0.254: IC1.26 27.89,35.08 v28.73,35.08 | v35.72,32.07 40.4,32.07 41.67,33.34 47.94,33.34 48.9,32.38 48.9,30.8 v48.26,30.16
  Bottom 0.254: v28.73,35.08 32.7,35.08 v35.72,32.07 | v48.26,30.16 47.62,29.53 IC3.19
TMS  (via drill 0.38)
  Top 0.254: IC1.46 37.7,36.04 v37.86,36.04 | v39.53,42.86 39.63,42.96 39.53,43.07 39.53,44.77 JTAG.2
  Bottom 0.254: v37.86,36.04 38.73,36.91 38.73,42.07 v39.53,42.86
TOP_B  (via drill 0.38)
  Top 0.254: IC1.53 36.67,42.45 v36.67,42.86
  Bottom 0.254: v36.67,42.86 36.67,44.45 33.97,47.15 R15.2
TOP_G  (via drill 0.38)
  Top 0.254: IC1.52 37.37,42.44 37.37,43.21 37.24,43.34 v37.24,45.56
  Bottom 0.254: v37.24,45.56 37.15,45.72 36.04,46.83 R14.2
TOP_R  (via drill 0.38)
  Top 0.254: IC1.51 37.85,42.21 37.85,44.99 | 37.85,44.99 | 37.85,44.99 37.94,45.09 37.94,45.88 37.91,45.91 37.62,46.2 v37.62,46.51
  Bottom 0.254: v37.62,46.51 38.1,46.99 R13.2
TRST
  Top 0.254: IC1.56 36.04,43.94 36.04,48.74 37.31,50.01 JTAG.10
TX  (via drill 0.38)
  Top 0.254: IC1.58 35.08,44.4 35.08,49.85 v36.04,50.8
  Bottom 0.254: v36.04,50.8 36.51,51.28 FTDI.5
VCC  (via drill 0.38)
  Top 0.254: C28.1 29.84,2.94 IC6.7 29.84,6.19 29.37,6.67 26.67,6.67 25.72,5.71 22.7,5.71 21.59,4.6 21.59,2.7 21.11,2.22 17.3,2.22 16.99,2.54 16.99,4.92 17.46,5.4 20,5.4 21.43,6.83 21.43,10 22.38,10.95 22.38,11.91 22.07,12.22 21.27,12.22 21.11,12.22 v18.41,12.22 | 35.83,39.32 35.78,39.37 30.48,39.37 | 35.83,39.32 IC1.48 | 27.3,39.37 26.04,40.01 26.04,40.63 IC1.13 24.12,42.55 C20.1 | 30.48,39.37 27.23,39.37 IC1.19 24.21,36.35 23.5,36.35 23.02,36.83 C1.1 | C4.1 31.11,46.8 IC1.64 31.11,44.67 30.48,44.67 | 30.48,44.67 IC1.1 | 30.48,39.37 30.48,44.67 | 30.43,33.38 30.48,33.43 | 30.43,33.38 IC1.32 30.8,30.99 C2.1 | 35.83,39.32 39.08,39.32 C3.1 39.05,39.61 39.05,40.64 43.08,44.67 43.4,44.67 JTAG.1 | 30.8,34.92 30.43,33.38 | v22.38,21.59 25.88,21.59 26.04,21.75 C17.1
  Top 0.406: 30.48,33.43 30.48,39.37 | C17.1 26.43,22.62 26.99,23.18 29.53,23.18 | 29.53,23.18 IC5.5 | 29.53,23.18 32.06,23.18 U1.5 v33.66,27.62 33.66,29.53 30.8,32.38 30.8,34.92
  Bottom 0.254: C8.1 38.73,30.56 IC3.12 38.73,27.94 38.42,27.62 v33.66,27.62 | v22.38,21.59 22.38,20.16 20.96,18.73 18.73,18.73 18.41,18.41 IC2.12 18.41,15.88 C7.1 18.34,15.79 18.41,15.56 v18.41,12.22
  pour Top: 30.8,32.38 37.47,39.05 30.8,45.72 24.13,39.05
VIN
  Top 0.254: RS.1 34.29,3.81 32.86,6.99 31.59,6.99 31.11,6.51 IC6.8
  pour Top (no thermals): 41.59,6.99 41.59,0 32.38,0 32.38,6.99
VOLTAGE_SENSE  (via drill 0.38)
  Top 0.254: v21.91,40.01 21.59,39.69 17.78,39.69 16.99,38.89 R10.1 14.07,38.95 13.49,39.53 R5.2 13.31,39.61 C6.1 | IC1.9 26,43.5 25.4,43.5 v25.08,43.18
  Bottom 0.254: v21.91,40.01 v25.08,43.18

### Text on the board
Bottom: . copyr. 2012 m. ferguson
tNames: 1 | 2 | 3 | 4 | FIX-IT-IN-SOFTWARE | V1.1
bNames: FUSION D59168